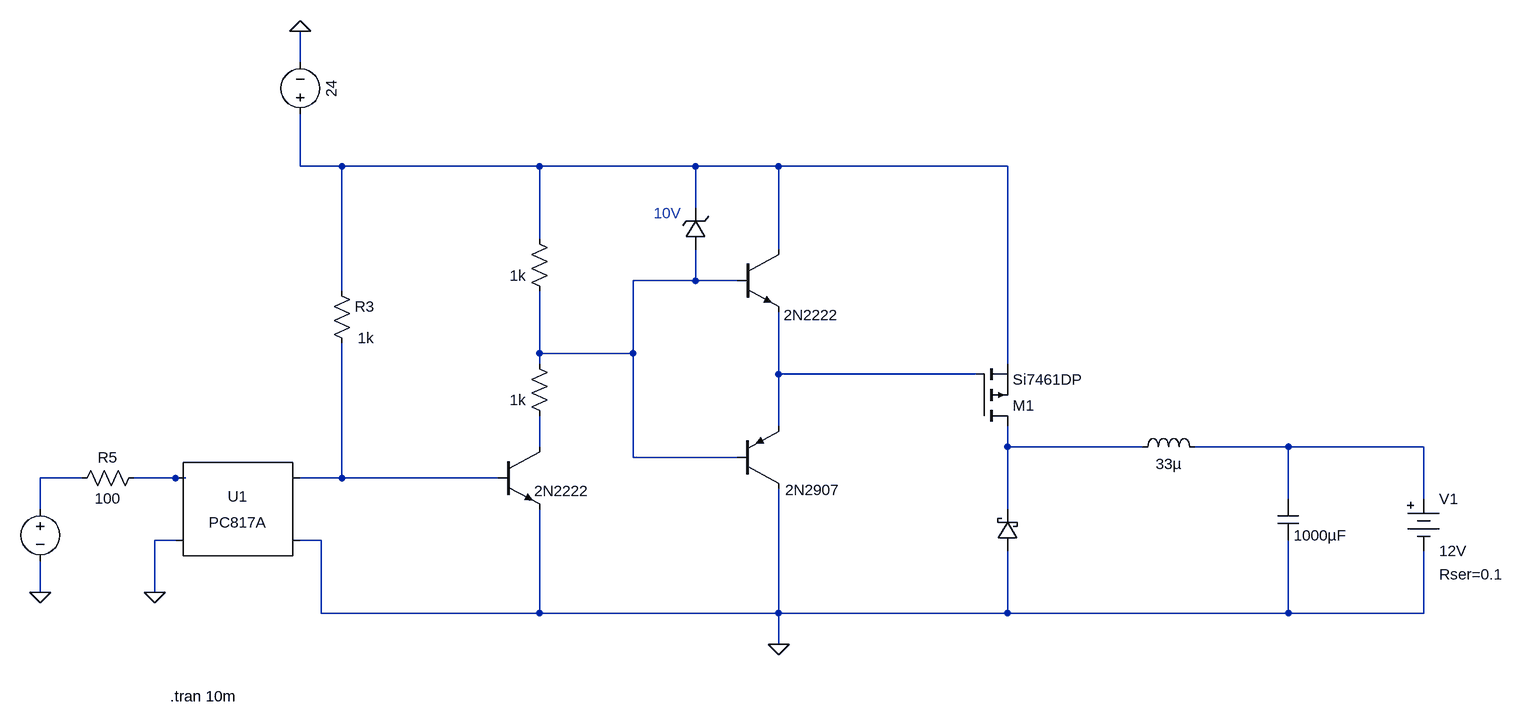
[diagram p0: schematic pmosfet with optocoupler.asc]
pmosfet with optocoupler.asc, the LTspice schematic file:
Version 4
SHEET 1 4320 680
WIRE -400 -560 -400 -608
WIRE -400 -400 -400 -480
WIRE -336 -400 -400 -400
WIRE -32 -400 -336 -400
WIRE 208 -400 -32 -400
WIRE 336 -400 208 -400
WIRE 688 -400 336 -400
WIRE 208 -336 208 -400
WIRE -32 -288 -32 -400
WIRE 336 -272 336 -400
WIRE 208 -224 208 -272
WIRE 208 -224 112 -224
WIRE 272 -224 208 -224
WIRE -336 -208 -336 -400
WIRE -32 -112 -32 -208
WIRE 112 -112 112 -224
WIRE 112 -112 -32 -112
WIRE -32 -96 -32 -112
WIRE 688 -96 688 -400
WIRE 336 -80 336 -176
WIRE 640 -80 336 -80
WIRE 336 0 336 -80
WIRE -32 32 -32 -16
WIRE 688 32 688 0
WIRE 896 32 688 32
WIRE 1120 32 976 32
WIRE 1328 32 1120 32
WIRE 112 48 112 -112
WIRE 272 48 112 48
WIRE -736 80 -800 80
WIRE -592 80 -656 80
WIRE -576 80 -592 80
WIRE -336 80 -336 -128
WIRE -336 80 -400 80
WIRE -96 80 -336 80
WIRE 1120 112 1120 32
WIRE 1328 112 1328 32
WIRE -800 128 -800 80
WIRE 688 128 688 32
WIRE -592 176 -624 176
WIRE -368 176 -400 176
WIRE -800 256 -800 208
WIRE -624 256 -624 176
WIRE -368 288 -368 176
WIRE -32 288 -32 128
WIRE -32 288 -368 288
WIRE 336 288 336 96
WIRE 336 288 -32 288
WIRE 688 288 688 192
WIRE 688 288 336 288
WIRE 1120 288 1120 176
WIRE 1120 288 688 288
WIRE 1328 288 1328 192
WIRE 1328 288 1120 288
WIRE 336 336 336 288
FLAG -400 -608 0
FLAG -800 256 0
FLAG -624 256 0
FLAG 336 336 0
SYMBOL ind 880 48 R270
WINDOW 0 32 56 Invisible 2
WINDOW 3 5 56 VBottom 2
SYMATTR InstName L1
SYMATTR Value 33µ
SYMBOL voltage -400 -464 R180
WINDOW 0 32 56 Invisible 2
WINDOW 3 -32 56 VBottom 2
WINDOW 123 0 0 Left 0
WINDOW 39 0 0 Left 0
SYMATTR InstName V2
SYMATTR Value 24
SYMBOL npn 272 -272 R0
WINDOW 0 56 32 Invisible 2
WINDOW 3 72 101 Left 2
SYMATTR InstName Q1
SYMATTR Value 2N2222
SYMBOL pnp 272 96 M180
WINDOW 0 84 32 Invisible 2
WINDOW 3 74 -2 Left 2
SYMATTR InstName Q2
SYMATTR Value 2N2907
SYMBOL res -16 -192 R180
WINDOW 0 36 76 Invisible 2
WINDOW 3 36 40 Left 2
SYMATTR InstName R1
SYMATTR Value 1k
SYMBOL npn -96 32 R0
WINDOW 0 56 32 Invisible 2
SYMATTR InstName Q3
SYMATTR Value 2N2222
SYMBOL res -16 0 R180
WINDOW 0 40 91 Invisible 2
WINDOW 3 36 40 Left 2
SYMATTR InstName R4
SYMATTR Value 1k
SYMBOL schottky 704 192 R180
WINDOW 0 24 64 Invisible 2
WINDOW 3 24 0 Invisible 2
SYMATTR InstName D3
SYMATTR Value RBR5LAM60A
SYMATTR Description Diode
SYMATTR Type diode
SYMBOL pmos 640 0 M180
SYMATTR InstName M1
SYMATTR Value Si7461DP
SYMBOL zener 224 -272 R180
WINDOW 0 24 64 Invisible 2
WINDOW 3 24 0 Invisible 2
SYMATTR InstName D2
SYMATTR Value EDZV9_1B
SYMBOL cap 1104 112 R0
WINDOW 0 24 8 Invisible 2
SYMATTR InstName C1
SYMATTR Value 1000µF
SYMBOL Misc\\battery 1328 96 R0
WINDOW 123 0 0 Left 0
WINDOW 39 24 132 Left 2
SYMATTR SpiceLine Rser=0.1
SYMATTR InstName V1
SYMATTR Value 12V
SYMBOL Optos\\PC817A -496 128 R0
SYMATTR InstName U1
SYMBOL voltage -800 112 R0
WINDOW 0 24 16 Invisible 2
WINDOW 3 24 96 Invisible 2
WINDOW 123 0 0 Left 0
WINDOW 39 0 0 Left 0
SYMATTR InstName V3
SYMATTR Value PULSE(5v 0v 1n 1n 1n 15u 30u)
SYMBOL res -352 -224 R0
WINDOW 3 40 88 Left 2
SYMATTR Value 1k
SYMATTR InstName R3
SYMBOL res -640 64 R90
WINDOW 0 0 56 VBottom 2
WINDOW 3 32 56 VTop 2
SYMATTR InstName R5
SYMATTR Value 100
TEXT 144 -328 Left 2 ;10V
TEXT -600 416 Left 2 !.tran 10m

The netlist it stands for:
* pmosfet with optocoupler.asc
L1 N005 N006 33µ
V2 N001 0 24
Q1 N001 N002 N003 0 2N2222
Q2 0 N002 N003 0 2N2907
R1 N002 N001 1k
Q3 N004 N009 0 0 2N2222
R4 N004 N002 1k
D3 0 N005 RBR5LAM60A
M1 N005 N003 N001 N001 Si7461DP
D2 N002 N001 EDZV9_1B
C1 N006 0 1000µF
V1 N006 0 12V Rser=0.1
XU1 N008 0 N009 0 PC817 Igain=1m
V3 N007 0 PULSE(5v 0v 1n 1n 1n 15u 30u)
R3 N001 N009 1k
R5 N008 N007 100
.model D D
.lib standard.dio
.model NPN NPN
.model PNP PNP
.lib standard.bjt
.model NMOS NMOS
.model PMOS PMOS
.lib standard.mos
* 10V
.tran 10m
.lib PC817.sub
.backanno
.end